# EAGLE design adc (EAGLE 6.3)
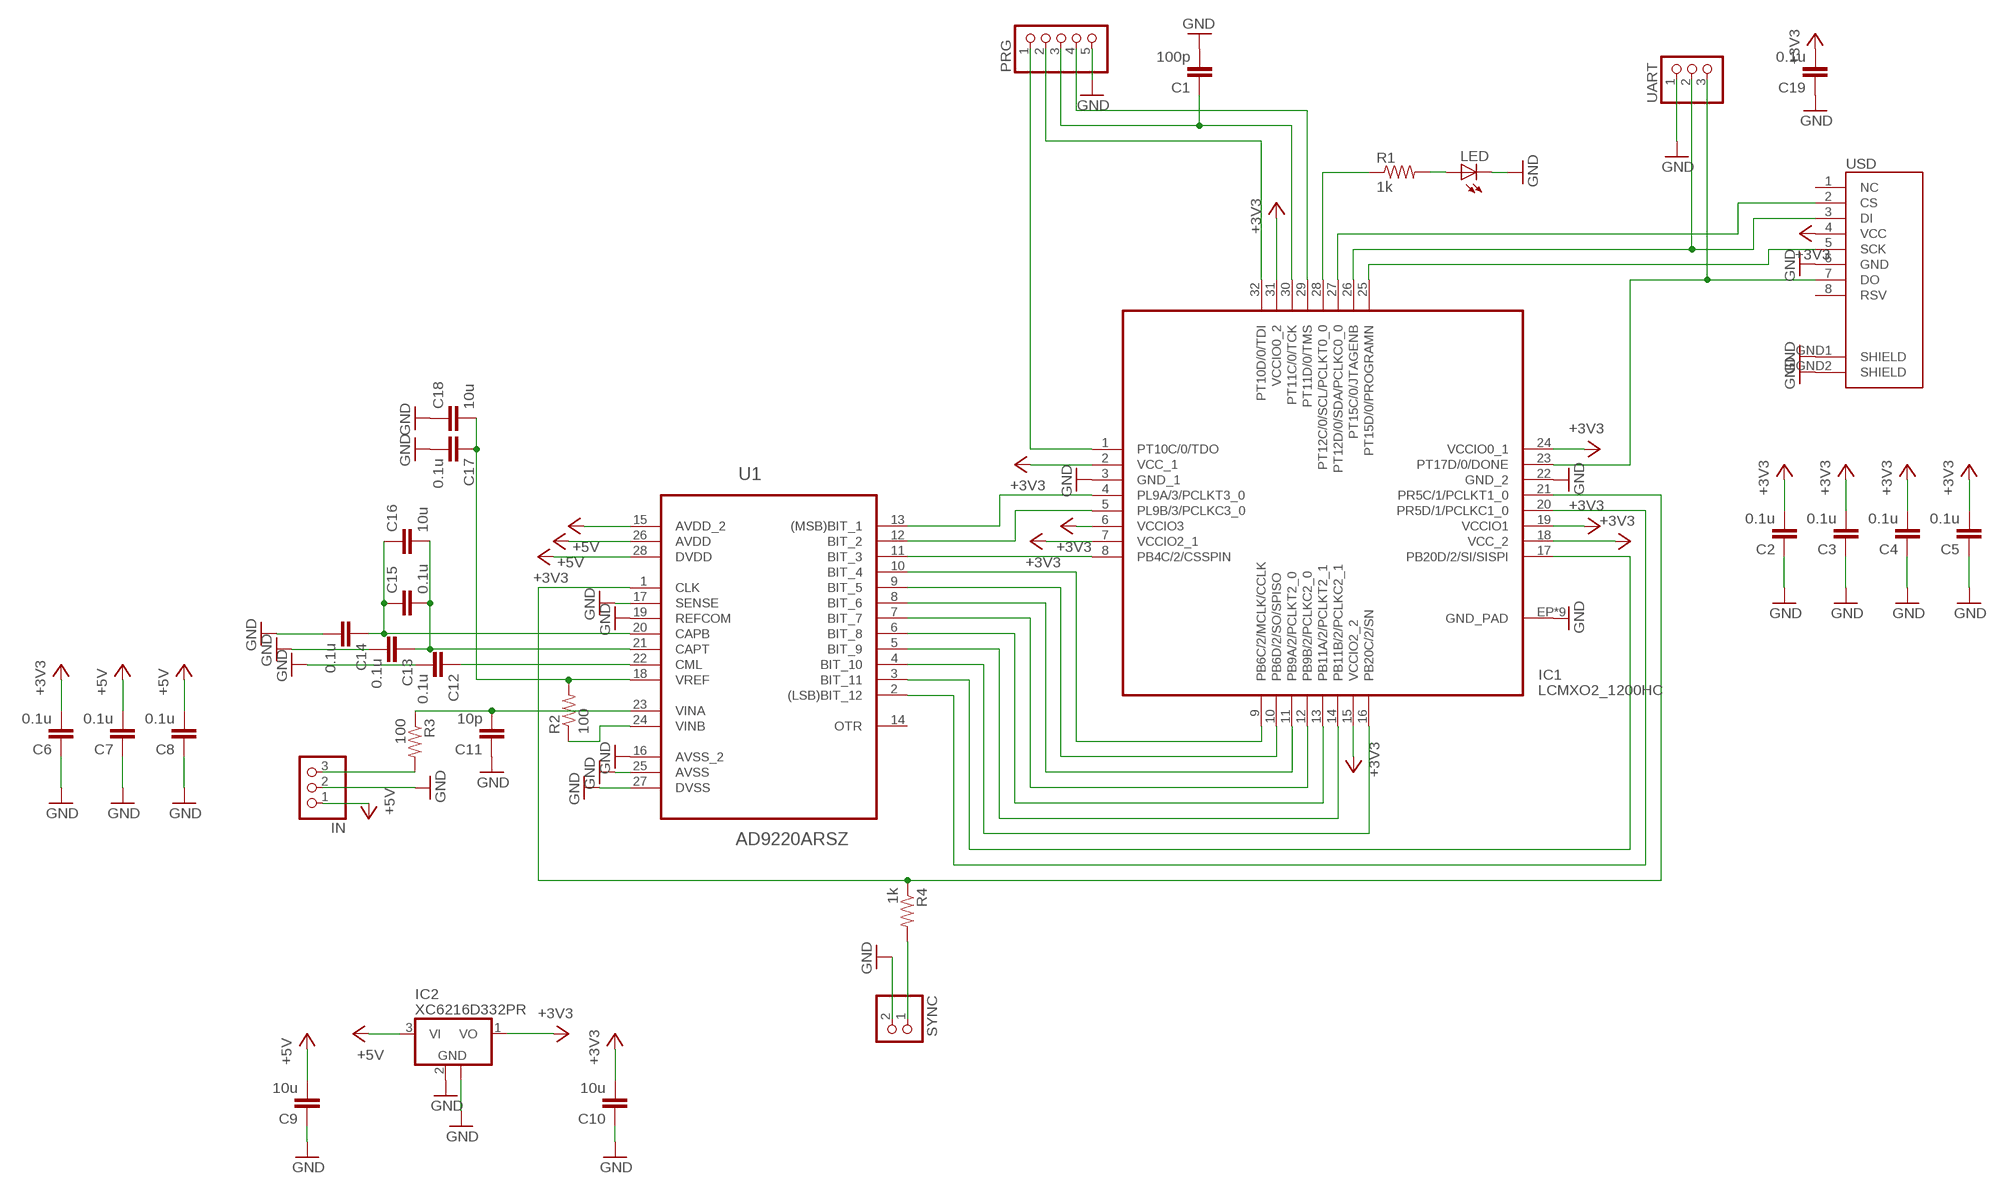
[diagram p0: schematic, sheet 1]

## Parts
C1  100p  C-EUC0603  [C0603]
C2  0.1u  C-EUC0603  [C0603]
C3  0.1u  C-EUC0603  [C0603]
C4  0.1u  C-EUC0603  [C0603]
C5  0.1u  C-EUC0603  [C0603]
C6  0.1u  C-EUC0603  [C0603]
C7  0.1u  C-EUC0603  [C0603]
C8  0.1u  C-EUC0603  [C0603]
C9  10u  C-EUC1206  [C1206]
C10  10u  C-EUC1206  [C1206]
C11  10p  C-EUC0603  [C0603]
C12  0.1u  C-EUC0603  [C0603]
C13  0.1u  C-EUC0603  [C0603]
C14  0.1u  C-EUC0603  [C0603]
C15  0.1u  C-EUC0603  [C0603]
C16  10u  C-EUC1206  [C1206]
C17  0.1u  C-EUC0603  [C0603]
C18  10u  C-EUC1206  [C1206]
C19  0.1u  C-EUC0603  [C0603]
IC1  LCMXO2_1200HC  [QFN32_5X5]
IC2  XC6216D332PR  78L05F  [SOT89]
IN  PINHD-1X3  [1X03]
LED  LEDSML0805  [SML0805]
PRG  PINHD-1X5  [1X05]
R1  1k  R-US_R0603  [R0603]
R2  100  R-US_R0603  [R0603]
R3  100  R-US_R0603  [R0603]
R4  1k  R-US_R0603  [R0603]
SYNC  PINHD-1X2  [1X02]
U1  AD9220ARSZ  [SOP65P780X200-28N]
UART  PINHD-1X3  [1X03]
USD  USD-SOCKETUSD  [USD-SOCKET-PP]

## Nets
+3V3: C2.2 C3.2 C4.2 C5.2 C6.2 C10.2 C19.2 IC1.2(VCC_1) IC1.6(VCCIO3) IC1.7(VCCIO2_1) IC1.15(VCCIO2_2) IC1.18(VCC_2) IC1.19(VCCIO1) IC1.24(VCCIO0_1) IC1.31(VCCIO0_2) IC2.1(VO) U1.28(DVDD) USD.4(VCC)
+5V: C7.2 C8.2 C9.2 IC2.3(VI) IN.1 U1.15(AVDD_2) U1.26(AVDD)
GND: C1.2 C2.1 C3.1 C4.1 C5.1 C6.1 C7.1 C8.1 C9.1 C10.1 C11.1 C12.2 C13.2 C14.2 C17.2 C18.1 C19.1 IC1.3(GND_1) IC1.22(GND_2) IC1.EP1(GND_PAD) IC1.EP2(GND_PAD) IC1.EP3(GND_PAD) IC1.EP4(GND_PAD) IC1.EP5(GND_PAD) IC1.EP6(GND_PAD) IC1.EP7(GND_PAD) IC1.EP(GND_PAD) IC1.PAD(GND_PAD) IC2.2(GND) IC2.2@1(GND) IN.2 LED.C PRG.5 SYNC.2 U1.16(AVSS_2) U1.17(SENSE) U1.19(REFCOM) U1.25(AVSS) U1.27(DVSS) UART.1 USD.6(GND) USD.GND1(SHIELD) USD.GND2(SHIELD)
N$1: IC1.4(PL9A/3/PCLKT3_0) U1.13((MSB)BIT_1)
N$2: IC1.5(PL9B/3/PCLKC3_0) U1.12(BIT_2)
N$3: IC1.8(PB4C/2/CSSPIN) U1.11(BIT_3)
N$4: IC1.9(PB6C/2/MCLK/CCLK) U1.10(BIT_4)
N$5: IC1.10(PB6D/2/SO/SPISO) U1.9(BIT_5)
N$6: IC1.11(PB9A/2/PCLKT2_0) U1.8(BIT_6)
N$7: IC1.12(PB9B/2/PCLKC2_0) U1.7(BIT_7)
N$8: IC1.13(PB11A/2/PCLKT2_1) U1.6(BIT_8)
N$9: IC1.14(PB11B/2/PCLKC2_1) U1.5(BIT_9)
N$10: IC1.16(PB20C/2/SN) U1.4(BIT_10)
N$11: IC1.17(PB20D/2/SI/SISPI) U1.3(BIT_11)
N$12: IC1.20(PR5D/1/PCLKC1_0) U1.2((LSB)BIT_12)
N$13: IC1.21(PR5C/1/PCLKT1_0) R4.1 U1.1(CLK)
N$14: IC1.1(PT10C/0/TDO) PRG.1
N$15: IC1.32(PT10D/0/TDI) PRG.2
N$16: C1.1 IC1.30(PT11C/0/TCK) PRG.3
N$17: IC1.29(PT11D/0/TMS) PRG.4
N$18: IC1.23(PT17D/0/DONE) UART.3 USD.7(DO)
N$19: IC1.25(PT15D/0/PROGRAMN) USD.5(SCK)
N$20: IC1.26(PT15C/0/JTAGENB) UART.2 USD.3(DI)
N$21: IC1.27(PT12D/0/SDA/PCLKC0_0) USD.2(CS)
N$23: IC1.28(PT12C/0/SCL/PCLKT0_0) R1.1
N$24: LED.A R1.2
N$25: R2.1 U1.24(VINB)
N$26: C17.1 C18.2 R2.2 U1.18(VREF)
N$27: C11.2 R3.1 U1.23(VINA)
N$28: IN.3 R3.2
N$29: C12.1 U1.22(CML)
N$30: C13.1 C15.2 C16.2 U1.21(CAPT)
N$31: C14.1 C15.1 C16.1 U1.20(CAPB)
N$32: R4.2 SYNC.1
Unconnected: U1.14(OTR) USD.1(NC) USD.8(RSV)

## Library data of the parts
C1-C19 = resistor:C-EU: CAPACITOR, European symbol
IC1 = machxo2:LCMXO2_1200HC: MAXHXO2 FPGA
IC2 = linear:78L*: POSITOIV-VOLTAGE REGULATORS Output up to 100 mA Source: http://focus.ti.com/lit/ds/symlink/ua78l05.pdf
IN UART = pinhead:PINHD-1X3: PIN HEADER
LED = led:LED: LED OSRAM: - CHIPLED LG R971, LG N971, LY N971, LG Q971, LY Q971, LO R971, LY R971 LH N974, LH R974 LS Q976, LO Q976, LY Q976 LO Q996 - Hyper CHIPLED LW Q18S LB Q993, LB Q99A, LB R99A - SideLED LS A670, LO A670, LY A670, LG A670, LP A670 LB A673, LV A673, LT A673, LW A673 LH A674 LY A675 LS A676, LA A676, LO A676, LY A676, LW A676 LS A679, LY A679, LG A679 - Hyper Micro SIDELED® LS Y876, LA Y876, LO Y876, LY Y876 LT Y87S - SmartLED LW L88C, LW L88S LB L89C, LB L89S, LG L890 LS L89K, LO L89K, LY L89K LS L896, LA L896, LO L896, LY L896 - TOPLED LS T670, LO T670, LY T670, LG T670, LP T670 LSG T670, LSP T670, LSY T670, LOP T670, LYG T670 LG T671, LOG T671, LSG T671 LB T673, LV T673, LT T673, LW T673 LH T674 LS T676, LA T676, LO T676, LY T676, LB T676, LH T676, LSB T676, LW T676 LB T67C, LV T67C, LT T67C, LS T67K, LO T67K, LY T67K, LW E67C LS E67B, LA E67B, LO E67B, LY E67B, LB E67C, LV E67C, LT E67C LW T67C LS T679, LY T679, LG T679 LS T770, LO T770, LY T770, LG T770, LP T770 LB T773, LV T773, LT T773, LW T773 LH T774 LS E675, LA E675, LY E675, LS T675 LS T776, LA T776, LO T776, LY T776, LB T776 LHGB T686 LT T68C, LB T68C - Hyper Mini TOPLED® LB M676 - Mini TOPLED Santana® LG M470 LS M47K, LO M47K, LY M47K Source: http://www.osram.convergy.de LUXEON: - LUMILED® LXK2-PW12-R00, LXK2-PW12-S00, LXK2-PW14-U00, LXK2-PW14-V00 LXK2-PM12-R00, LXK2-PM12-S00, LXK2-PM14-U00 LXK2-PE12-Q00, LXK2-PE12-R00, LXK2-PE12-S00, LXK2-PE14-T00, LXK2-PE14-U00 LXK2-PB12-K00, LXK2-PB12-L00, LXK2-PB12-M00, LXK2-PB14-N00, LXK2-PB14-P00, LXK2-PB14-Q00 LXK2-PR12-L00, LXK2-PR12-M00, LXK2-PR14-Q00, LXK2-PR14-R00 LXK2-PD12-Q00, LXK2-PD12-R00, LXK2-PD12-S00 LXK2-PH12-R00, LXK2-PH12-S00 LXK2-PL12-P00, LXK2-PL12-Q00, LXK2-PL12-R00 Source: www.luxeon.com KINGBRIGHT: KA-3528ASYC Source: www.kingbright.com
PRG = pinhead:PINHD-1X5: PIN HEADER
R1-R4 = resistor:R-US_: RESISTOR, American symbol
SYNC = pinhead:PINHD-1X2: PIN HEADER
U1 = analog devices_by_element14_batch_1:AD9220ARSZ: Complete 12-Bit 1.5/3.0/10.0 MSPS Monolithic A/D Converters; MPN: AD9220ARSZ; OC_FARNELL: 1852808; OC_NEWARK: 59K7155; PACKAGE: TSSOP-28; SUPPLIER: ANALOG DEVICES
USD = microsd:USD-SOCKET: microSD Socket Push-push type uSD socket. Schematic element and footprint production proven. Spark Fun Electronics SKU : PRT-00127. tDoc lines correctly indicate media card edge positions when inserting (unlocked, locked, depressed).

## Board
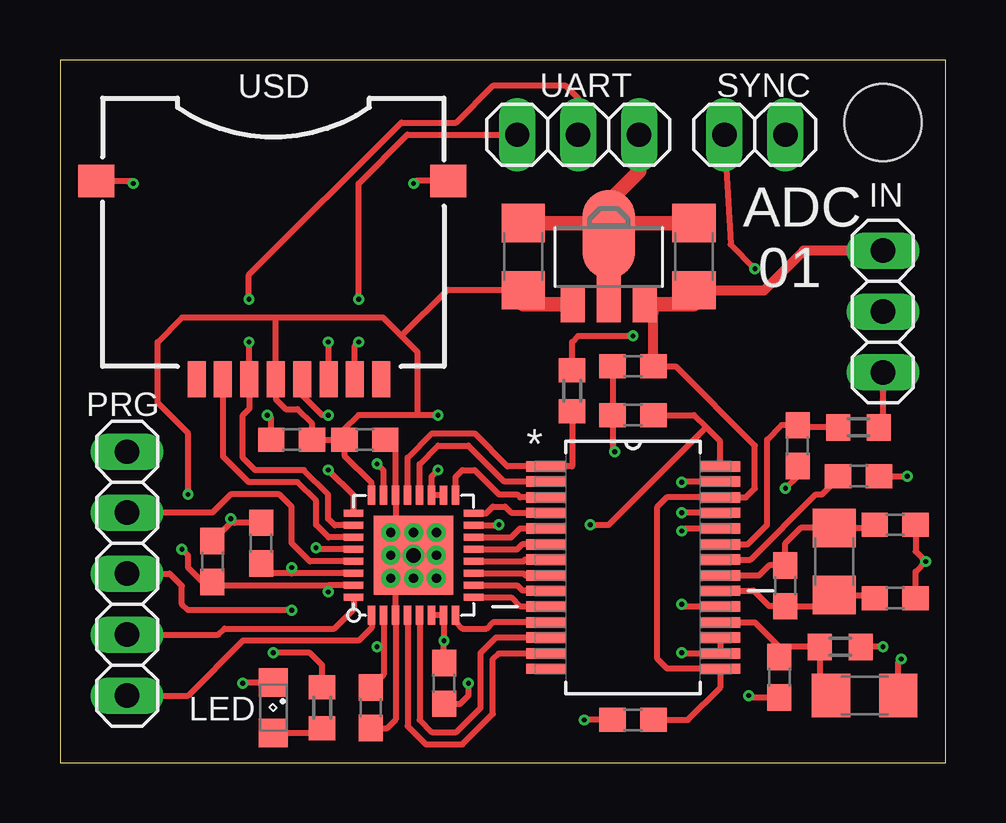
[diagram p1: board, top side]
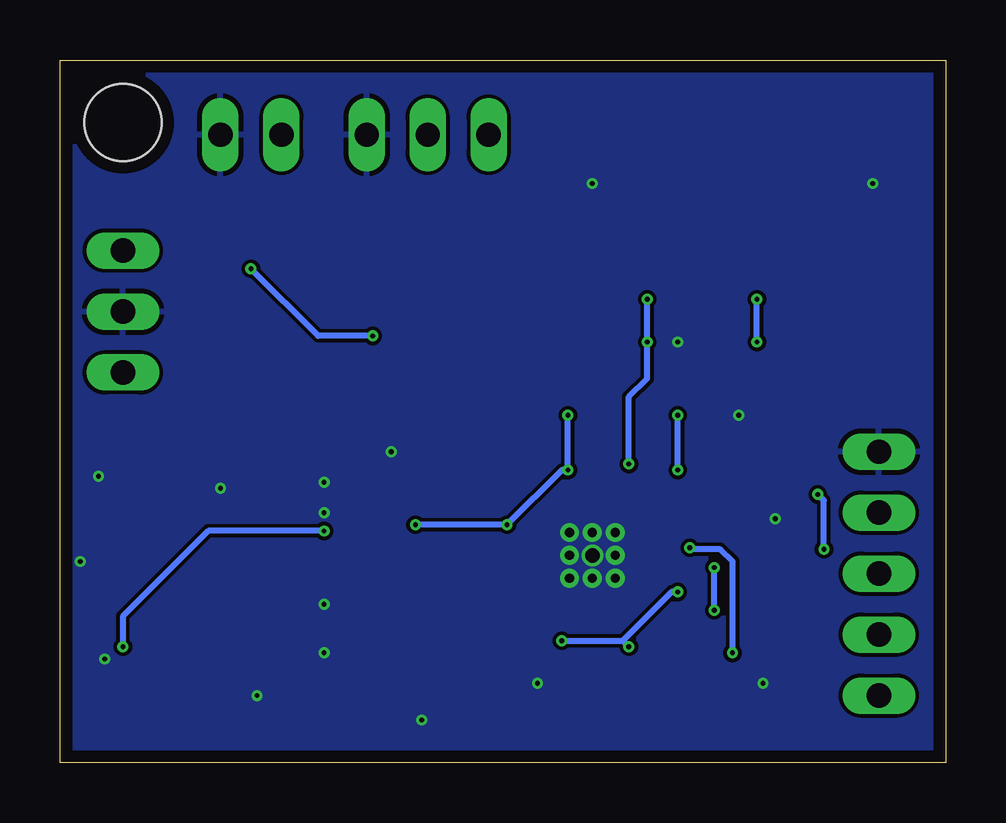
[diagram p2: board, bottom side, seen from below]

Size 36.91 x 29.28 mm. Coordinates in mm from the lower left corner, seen from the top.
Outline: 0,0 36.91,0 36.91,29.28 0,29.28 0,0
Copper layers (1*16): Top 0.035mm / dielectric 1.5mm / Bottom 0.035mm
Design rules "PCBCart-proto *": minimum track width 5mil, minimum drill 0.2mm, track to track 6mil, track to pad 6mil, pad to pad 6mil, via to via 6mil, smd to smd 5mil, copper to edge 20mil, drill to drill 8mil, minimum pad ring 8mil, minimum via ring 5mil, stop-mask expansion 3mil, vias tented up to drill 0mil, thermal gap 8mil
Holes 3.2 mm at 34.29,26.67

### Footprints (pad centres in the part's own frame; a part is rotated, then mirrored left to right if it is on the bottom)
C0603 = smd 1.1 x 1: 1 -0.85,0; 2 0.85,0
C1206 = smd 1.6 x 1.8: 1 -1.4,0; 2 1.4,0
QFN32_5X5 = smd 0.8 x 0.3: 1 -2.5,1.75; 2 -2.5,1.25; 3 -2.5,0.75; 4 -2.5,0.25; 5 -2.5,-0.25; 6 -2.5,-0.75; 7 -2.5,-1.25; 8 -2.5,-1.75; 17 2.5,-1.75; 18 2.5,-1.25; 19 2.5,-0.75; 20 2.5,-0.25; 21 2.5,0.25; 22 2.5,0.75; 23 2.5,1.25; 24 2.5,1.75 | smd 0.3 x 0.8: 9 -1.75,-2.5; 10 -1.25,-2.5; 11 -0.75,-2.5; 12 -0.25,-2.5; 13 0.25,-2.5; 14 0.75,-2.5; 15 1.25,-2.5; 16 1.75,-2.5; 25 1.75,2.5; 26 1.25,2.5; 27 0.75,2.5; 28 0.25,2.5; 29 -0.25,2.5; 30 -0.75,2.5; 31 -1.25,2.5; 32 -1.75,2.5 | drill 0.381: EP -0.953,0.953; EP1 -0.953,0; EP2 -0.953,-0.953; EP3 0,-0.953; EP4 0.953,-0.953; EP5 0.953,0; EP6 0.953,0.953; EP7 0,0.953 | smd 3.3 x 3.3: PAD 0,0
SOT89 = smd 1 x 1.5: 1 -1.499,-1.981; 3 1.499,-1.981 | smd 1 x 2: 2 0,-1.727 | smd 2.2 x 3.7: 2@1 0,0.94
1X03 = drill 1.016 long: 1 -2.54,0; 2 0,0; 3 2.54,0
SML0805 = smd 1.2 x 1.2: A 1.05,0; C -1.05,0
1X05 = drill 1.016 long: 1 -5.08,0; 2 -2.54,0; 3 0,0; 4 2.54,0; 5 5.08,0
R0603 = smd 1 x 1.1: 1 -0.85,0; 2 0.85,0
1X02 = drill 1.016 long: 1 -1.27,0; 2 1.27,0
SOP65P780X200-28N = smd 1.651 x 0.432: 1 -3.632,4.216; 2 -3.632,3.581; 3 -3.632,2.921; 4 -3.632,2.286; 5 -3.632,1.626; 6 -3.632,0.965; 7 -3.632,0.33; 8 -3.632,-0.33; 9 -3.632,-0.965; 10 -3.632,-1.626; 11 -3.632,-2.286; 12 -3.632,-2.921; 13 -3.632,-3.581; 14 -3.632,-4.216; 15 3.632,-4.216; 16 3.632,-3.581; 17 3.632,-2.921; 18 3.632,-2.286; 19 3.632,-1.626; 20 3.632,-0.965; 21 3.632,-0.33; 22 3.632,0.33; 23 3.632,0.965; 24 3.632,1.626; 25 3.632,2.286; 26 3.632,2.921; 27 3.632,3.581; 28 3.632,4.216
USD-SOCKET-PP = smd 0.75 x 1.5: 1 3.2,6.132; 2 2.1,6.132; 3 1,6.132; 4 -0.1,6.132; 5 -1.2,6.132; 6 -2.3,6.132; 7 -3.4,6.132; 8 -4.5,6.132 | smd 1.5 x 1.35: GND1 -7.291,-2.137; GND2 7.375,-2.137

### Placement (x,y rotation side)
C1  8.38,9.14 90 top
C2  12.95,2.29 90 top
C3  6.35,8.38 270 top
C4  12.7,13.46 180 top
C5  16,3.3 90 top
C6  23.88,14.48 0 top
C7  23.88,1.78 0 top
C8  23.88,16.51 0 top
C9  26.42,21.08 270 top
C10  19.3,21.08 270 top
C11  30.73,13.21 90 top
C12  33.27,11.94 0 top
C13  34.8,9.91 0 top
C14  34.8,6.86 0 top
C15  30.23,7.37 90 top
C16  32.26,8.38 90 top
C17  29.97,3.56 270 top
C18  33.53,2.79 180 top
C19  9.65,13.46 0 top
IC1  14.73,8.64 90 top
IC2  22.86,21.08 0 top
IN  34.29,18.8 270 top
LED  8.89,2.29 270 top
PRG  2.79,7.87 90 top
R1  10.92,2.29 270 top
R2  32.51,4.83 180 top
R3  33.27,13.97 0 top
R4  21.34,15.49 90 top
SYNC  28.96,26.16 0 top
U1  23.88,8.13 0 top
UART  21.59,26.16 180 top
USD  8.89,22.1 180 top

### Tracks (layer width: path | path; a pad name or v marks a point on that pad's centre or on a via)
+3V3  (via drill 0.2)
  Top 0.254: IC1.6 IC1.7 15.98,5.1 | IC1.2 13.48,4.83 | 13.48,4.83 13.48,3.66 C2.2 | 15.98,5.1 15.98,4.17 C5.2 | 15.98,5.1 v16,5.08 | v13.21,4.83 13.48,4.83 | C6.2 26.42,14.48 26.92,13.97 | 26.92,13.97 27.51,13.39 U1.28 | IC1.31 11.18,7.39 v11.18,7.11 11.18,7.37 6.52,7.37 C3.2 5.93,7.53 5.33,8.13 5.33,8.64 v5.08,8.89 | IC1.15 18.27,9.89 v18.29,9.91 | 15.49,11.94 v15.75,12.19 15.48,11.93 IC1.19 IC1.18 | v5.33,11.18 5.33,13.72 4.06,14.99 4.06,17.53 5.08,18.54 8.99,18.54 | 14.22,17.78 13.46,18.54 8.99,18.54 | 14.22,17.78 14.9,17.11 14.9,14.57 14.99,14.48 | v22.1,9.91 22.86,9.91 26.92,13.97 | C10.2 16.13,19.68 14.22,17.78 | IC1.24 12.98,11.66 11.85,12.79 C4.2 | v15.75,14.48 14.99,14.48 | 14.99,14.48 12.45,14.48 11.85,13.88 C4.2 | C4.2 C19.2 10.5,14.14 9.91,14.73 9.4,14.73 8.99,15.14 USD.4 8.99,18.54
  Top 0.61: IC2.1 19.3,19.1 C10.2
  Bottom 0.254: v16,5.08 13.46,5.08 | v11.18,7.11 11.43,7.11 13.46,5.08 | 13.46,5.08 v13.21,4.83 | v15.75,14.48 v15.75,12.19 16,12.19 v18.29,9.91 v22.1,9.91 | v5.08,8.89 5.08,10.92 v5.33,11.18
+5V
  Top 0.254: C7.2 26.16,1.78 27.51,3.12 U1.15 25.3,3.91 24.89,4.32 24.89,10.67 25.27,11.05 U1.26 28.57,11.05 28.96,11.43 28.96,13.21 25.65,16.51 C8.2
  Top 0.406: C8.2 24.73,18.73 IC2.3 | IN.1 30.99,21.34 29.33,19.68 C9.2
  Top 0.61: IC2.3 26.42,19.1 C9.2
GND  (via drill 0.2, 0.6)
  Top 0.254: IC1.EP6 13.98,9.79 IC1.22 13.98,13.36 C4.1 | IC1.EP 13.98,7.48 IC1.3 13.98,1.79 13.63,1.44 C2.1 | C5.1 16.68,2.45 17.02,2.79 v17.02,3.3 | C3.1 7.11,9.99 C1.2 7.28,9.99 v7.11,10.16 | U1.25 v25.91,10.41 | v25.91,4.57 25.93,4.55 U1.16 U1.17 | U1.27 25.93,11.71 v25.91,11.68 | USD.GND2 2.94,24.23 v3.05,24.13 | USD.GND1 14.84,24.23 v14.73,24.13 | USD.6 11.19,17.51 v11.18,17.53 | U1.19 26.01,6.5 v25.91,6.6 | C7.1 v21.84,1.78 | C8.1 C6.1 23.03,13.04 v23.11,12.95 | C14.2 35.65,7.96 v36.07,8.38 35.65,8.8 C13.2 | LED.C 7.65,3.34 v7.62,3.3 | C12.2 v35.31,11.94 | C19.1 8.8,14.39 v8.64,14.48 | C18.1 34.93,4.19 v35.05,4.32 | C17.2 28.79,2.71 v28.7,2.79 | C11.1 30.73,11.94 v30.23,11.43
  Top 0.61: C10.1 22.86,22.48 | C9.1 22.86,22.48 | 22.86,22.48 IC2.2@1 IC2.2 22.86,23.37 24.13,24.64 UART.1
  other vias: 14.73,8.64
  pour Bottom: -0.76,29.97 37.59,30.23 37.59,-0.51 -0.76,-0.76
N$1
  Top 0.254: U1.13 18.26,4.55 18.03,4.32 18.03,2.03 16.76,0.76 15.24,0.76 14.48,1.52 IC1.4
N$2
  Top 0.254: U1.12 18.16,5.21 17.53,4.57 17.53,2.29 16.51,1.27 15.49,1.27 14.98,1.78 IC1.5
N$3
  Top 0.254: IC1.8 16.48,5.87 16.76,5.59 17.78,5.59 18.03,5.84 U1.11
N$4
  Top 0.254: IC1.9 18.8,6.89 19.18,6.5 U1.10
N$5
  Top 0.254: IC1.10 19.05,7.39 19.27,7.16 U1.9
N$6
  Top 0.254: IC1.11 19.3,7.89 19.39,7.8 U1.8
N$7
  Top 0.254: IC1.12 19.3,8.39 19.38,8.46 U1.7
N$8
  Top 0.254: IC1.13 19.05,8.89 19.26,9.09 U1.6
N$9
  Top 0.254: IC1.14 18.8,9.39 19.16,9.75 U1.5
N$10
  Top 0.254: IC1.16 17.75,10.39 18.03,10.67 18.54,10.67 18.8,10.41 U1.4
N$11
  Top 0.254: IC1.17 16.48,11.91 16.76,12.19 17.27,12.19 18.29,11.18 19.05,11.18 19.18,11.05 U1.3
N$12
  Top 0.254: IC1.20 14.98,12.44 15.75,13.21 17.02,13.21 18.52,11.71 U1.2
N$13
  Top 0.254: IC1.21 14.48,12.7 15.49,13.72 17.27,13.72 18.64,12.34 U1.1 | 20.57,12.34 U1.1 | R4.1 21.34,12.34 U1.1
N$14
  Top 0.254: IC1.1 12.98,5.62 12.45,5.08 7.62,5.08 5.33,2.79 PRG.1
N$15
  Top 0.254: PRG.2 6.6,5.33 6.86,5.59 11.43,5.59 12.23,6.39 IC1.32
N$16  (via drill 0.2)
  Top 0.254: IC1.30 9.65,7.89 | 9.65,7.89 8.79,7.89 C1.1 | v9.65,8.13 9.65,7.89 | PRG.3 4.57,7.87 5.08,7.37 5.08,6.6 5.33,6.35 v9.65,6.35
  Bottom 0.254: v9.65,6.35 v9.65,8.13
N$17
  Top 0.254: IC1.29 10.41,8.39 9.65,9.14 9.65,10.67 9.14,11.18 7.11,11.18 6.35,10.41 PRG.4
N$18  (via drill 0.2)
  Top 0.254: IC1.23 13.48,12.17 v13.21,12.45 | USD.7 12.29,17.37 v12.45,17.53 | v12.45,19.3 12.45,24.13 14.48,26.16 UART.3
  Bottom 0.254: v13.21,12.45 13.21,15.24 12.45,16 v12.45,17.53 v12.45,19.3
N$19  (via drill 0.2)
  Top 0.254: IC1.25 12.23,11.14 v11.18,12.19 | USD.5 10.09,15.31 10.92,14.48 v11.18,14.48
  Bottom 0.254: v11.18,12.19 v11.18,14.48
N$20  (via drill 0.2)
  Top 0.254: IC1.26 11.45,9.89 11.18,10.16 11.18,11.18 10.16,12.19 8.13,12.19 7.62,12.7 7.62,14.48 7.89,14.75 USD.3 7.89,17.51 v7.87,17.53 | v7.87,19.3 7.87,20.32 14.22,26.67 16.51,26.67 18.03,28.19 21.08,28.19 21.59,27.69 UART.2
  Bottom 0.254: v7.87,17.53 v7.87,19.3
N$21
  Top 0.254: IC1.27 11.19,9.39 10.67,9.91 10.67,10.92 9.91,11.68 7.87,11.68 6.79,12.77 USD.2
N$23  (via drill 0.2)
  Top 0.254: R1.1 10.92,4.06 10.41,4.57 v8.89,4.57 | IC1.28 10.67,8.89 v10.67,8.95
  Bottom 0.254: v8.89,4.57 8.89,8.38 9.4,8.89 10.61,8.89 v10.67,8.95
N$24
  Top 0.254: LED.A 10.92,1.24 R1.2
N$25  (via drill 0.2)
  Top 0.254: U1.24 26.06,9.75 v25.91,9.65 | v34.29,4.83 R2.1
  Bottom 0.254: v25.91,9.65 30.73,9.65 34.29,6.1 v34.29,4.83
N$26
  Top 0.254: U1.18 28.96,5.84 29.97,4.83 C17.1 30.14,4.83 R2.2 31.66,3.26 C18.2
N$27
  Top 0.254: U1.23 28.65,9.09 29.46,9.91 29.46,13.46 30.06,14.06 C11.2 30.82,13.97 R3.1
N$28
  Top 0.254: IN.3 34.29,14.14 R3.2
N$29
  Top 0.254: U1.22 28.78,8.46 31.5,11.18 31.75,11.18 32.42,11.85 C12.1
N$30
  Top 0.254: U1.21 29.13,7.8 29.55,8.22 C15.2 30.23,9.14 30.86,9.78 C16.2 33.82,9.78 C13.1
N$31
  Top 0.254: U1.20 28.91,7.16 29.55,6.52 C15.1 31.79,6.52 C16.1 33.82,6.98 C14.1
N$32  (via drill 0.2)
  Top 0.254: R4.2 21.34,17.53 21.59,17.78 v23.88,17.78 | SYNC.1 27.94,21.59 v28.96,20.57
  Bottom 0.254: v23.88,17.78 26.16,17.78 v28.96,20.57

### Text on the board
tNames: ADC / 01